# EAGLE design DiodeBoard (EAGLE 9.1.0)
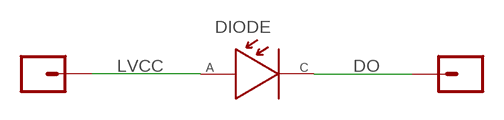
[diagram p0: schematic, sheet 1]

## Parts
DI  SINGLE-THROUGH-HOLE  [SINGLE-THROUGH-HOLE]
DIODE  PHOTODIODEBPW  [BPW34_BP104_SMD]
DO  SINGLE-THROUGH-HOLE  [SINGLE-THROUGH-HOLE]

## Nets
DO: DIODE.CATHODE DO.1
LVCC: DI.1 DIODE.ANODE

## Library data of the parts
DI DO = ZippyComponentLibrary:SINGLE-THROUGH-HOLE
DIODE = ZippyComponentLibrary:PHOTODIODE: "2x1 SMD Mounting Point For BPW34 Diode"

## Board
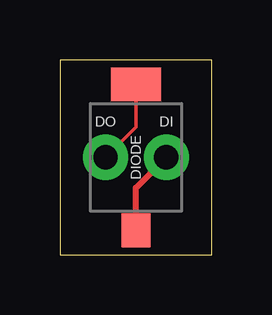
[diagram p1: board, top side]

Size 6.35 x 8.13 mm. Coordinates in mm from the lower left corner, seen from the top.
Outline: 0,0 6.35,0 6.35,8.13 0,8.13 0,0
Copper layers (1*16): Top 0.0356mm / dielectric 1.5011mm / Bottom 0.0356mm
Design rules "LaenPCBOrder *": minimum track width 6mil, minimum drill 13mil, track to track 6mil, track to pad 6mil, pad to pad 6mil, via to via 6mil, smd to smd 6mil, copper to edge 12mil, drill to drill 6mil, minimum pad ring 7mil, minimum via ring 7mil, stop-mask expansion 3mil, vias tented up to drill 0mil, thermal gap 10mil

### Footprints (pad centres in the part's own frame; a part is rotated, then mirrored left to right if it is on the bottom)
SINGLE-THROUGH-HOLE = drill 1.016 pad 1.88: 1 0,0
BPW34_BP104_SMD = smd 1.4 x 1.2: ANODE -3.05,0 | smd 1.4 x 2.1: CATHODE 3.05,0

### Placement (x,y rotation side)
DI  4.45,4.06 0 top
DIODE  3.17,4.06 90 top
DO  1.91,4.06 0 top

### Tracks (layer width: path | path; a pad name or v marks a point on that pad's centre or on a via)
DO
  Top 0.152: DIODE.CATHODE 3.17,5.33 DO.1
LVCC
  Top 0.254: DIODE.ANODE 3.17,2.79 DI.1